# Altium schematic sheet Power.SchDoc
size A4
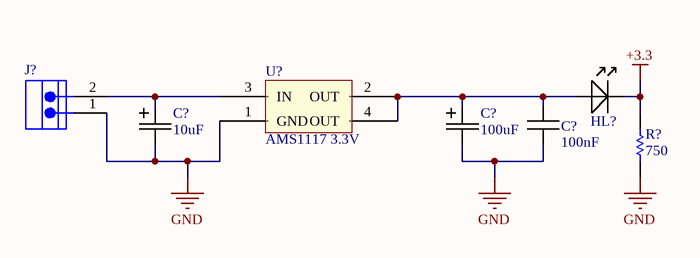
[diagram p0: Power.SchDoc]

## Parts
(Parts that share a designator on the sheet are numbered #1, #2 ... from top to bottom, then left to right.)
C?#1  Val: 10uF  [CAP_ELEC_5*11]  (hidden comment: CAP_ELEC_5*11)
C?#2  Val: 100uF  [CAP_ELEC_8*11]  (hidden comment: CAP_ELEC_8*11)
C?#3  Val: 100nF  [CAP0805]  (hidden comment: CAP_SMD)
HL?  LED_SMD  [1206_Led]  (value not drawn)
J?  (no value)  [KF350-3.5-02P]
R?  Val: 750  [RES0805]  (hidden comment: RES_SMD)
U?  AMS1117 3.3V  [SOT223-4]

## Nets
+3.3: HL?.2(cathode) R?.2
GND: C?#1.1 C?#2.1 C?#3.1 J?.1 R?.1 U?.1(GND)
NetC?#1_2: C?#1.2 J?.2 U?.3(IN)
NetC?#2_2: C?#2.2 C?#3.2 HL?.1(anode) U?.2(OUT) U?.4(OUT)

## Library data of the parts
C?#1 = CAP_ELEC_5*11: Electrolitic capacitor
C?#2 = CAP_ELEC_8*11: Electrolitic capacitor
C?#3 = CAP_SMD: Ceramic capacitor, 0805
HL? = LED_SMD: 0805 led
J? = Terminal_2: Euro Terminal Block, 6 A, 150 V, -40 to 105 degC, Pitch 2.54 mm, 1x2 Position, Height 8.6 mm, Tail Length 3.3 mm; Manufacturer: Cixi KaiFeng; PartNumber: KF120-02P-14; Rated Current: 6 A; Contact: Brass; Insulation Resistance: 5000 MOhm / 1000 V; Rated Voltage: 150 V; No. of Pole: 2; Withstanding Voltage: AC 1500 V / 1 Min; Contact Resistance: 20 mOhm; Pitch: Single Pitch; PackageReference: KF120-2; Color: Green; Mounting Technology: Through Hole; PackageDescription: Terminal Block, Pitch 2.54 mm, 1 x 2 Position, Height 8.6 mm, Tail Length 3.3 mm; ComponentLink2Description: Datasheet; ComponentLink1Description: Manufacturer URL; ComponentLink2URL: http://www.nb-kaifeng.com/upload/editor/ext_pdf/201305290533202245.pdf; Temp. Range: -40 to 105 degC; ComponentLink1URL: http://www.nb-kaifeng.com/
U? = AMS1117: Voltage regulator